# Altium schematic sheet LPCB230 - TC CHANNEL.SchDoc
size A3; Address1: Factory 10; Address2: 9-13 Dingley Avenue, Dandeong, VICTORIA 3175, AUSTRALIA; DocumentNumber: 3; Revision: 1; SheetNumber: 3; SheetTotal: 3; Lockie__PCB_SUB_ASSEMBLY: Single Channel; Lockie__PCB_ASSEMBLY: Interface; Lockie__LDL: LPCB230; Lockie__PCB_DESCRIPTION: Thermocouple Interface
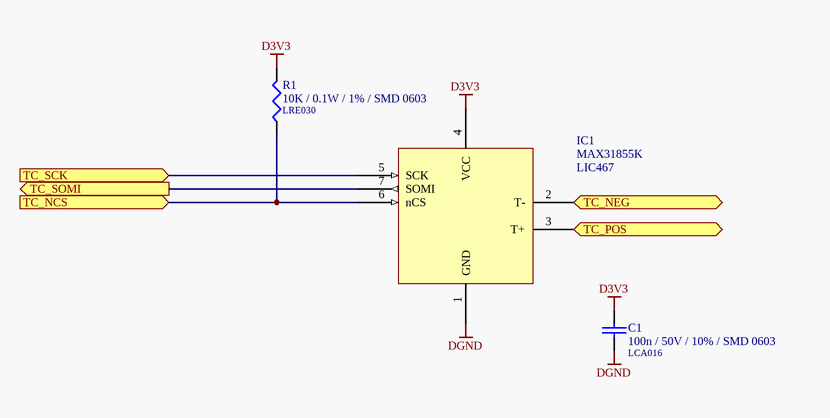
[diagram p0: LPCB230 - TC CHANNEL.SchDoc]

## Parts
C1  100n / 50V / 10% / SMD 0603  LDL_NUMBER: LCA016  [LFP011__CC1608-0603-IPC7351_B]
IC1  MAX31855K  LDL_NUMBER: LIC467  [LFP017__SO-G8/Y1.9]
R1  10K / 0.1W / 1% / SMD 0603  LDL_NUMBER: LRE030  [LFP020__CR1608-0603-IPC7351_B]

## Ports
TC_NCS (in), TC_NEG (bidir), TC_POS (bidir), TC_SCK (in), TC_SOMI (out)

## Nets
D3V3: C1.1 IC1.4(VCC) R1.2
DGND: C1.2 IC1.1(GND)
TC_NCS: IC1.6(nCS) R1.1 ; port TC_NCS
TC_NEG: IC1.2(T-) ; port TC_NEG
TC_POS: IC1.3(T+) ; port TC_POS
TC_SCK: IC1.5(SCK) ; port TC_SCK
TC_SOMI: IC1.7(SOMI) ; port TC_SOMI

## Notes on the sheet
- PCB COMPONENT DESCRIPTION
- LDL NUMBER
- Assembly Details
- Size
- Drawing File Name
- Revision
- http://rloop.org
- Scale
- A3
- Sheet Details
- N.T.S
- Sheet:
- Of:

## Library data of the parts
C1 = 100n / 50V / 10% / SMD 0603: Capacitor, Ceramic Chip, 100nF (0.1uF), 50V, 5%, SMD 0603 [LCA016]; FMEDA__OPERATING__VOLTAGE_MIN: 0; FMEDA__OPERATING__VOLTAGE_MAX: 3.3; FMEDA__OPERATING__TEMP_MIN: -20; FMEDA__OPERATING__TEMP_TYP: 27; FMEDA__OPERATING__TEMP_MAX: 50; FMEDA__CHANNEL: COM; Value: 100n; FMEDA__FUNCTION_IN_SYSTEM: *; FMEDA__OPERATING__VOLTAGE_TYP: 3.3
IC1 = MAX31855K: IC, Thermocouple Interface, Type K, SMD SOIC-8 [LIC467]
R1 = 10K / 0.1W / 1% / SMD 0603: Resistor, Ceramic Chip, 10K, 0.1W, 1%, SMD 0603 [LRE030]; FMEDA__OPERATING__POWER_MAX: 0; FMEDA__OPERATING__TEMP_MAX: 50; FMEDA__OPERATING__TEMP_MIN: -20; FMEDA__OPERATING__TEMP_TYP: 27; FMEDA__CHANNEL: COM; Value: 10K; FMEDA__OPERATING__POWER_MIN: 0; FMEDA__OPERATING__VOLTAGE_MAX: 0; FMEDA__OPERATING__VOLTAGE_MIN: 0; FMEDA__OPERATING__VOLTAGE_TYP: 0; FMEDA__FUNCTION_IN_SYSTEM: *